# Altium schematic sheet pin-marker-bubbles-1p2.SchDoc
size 101 x 76 mm
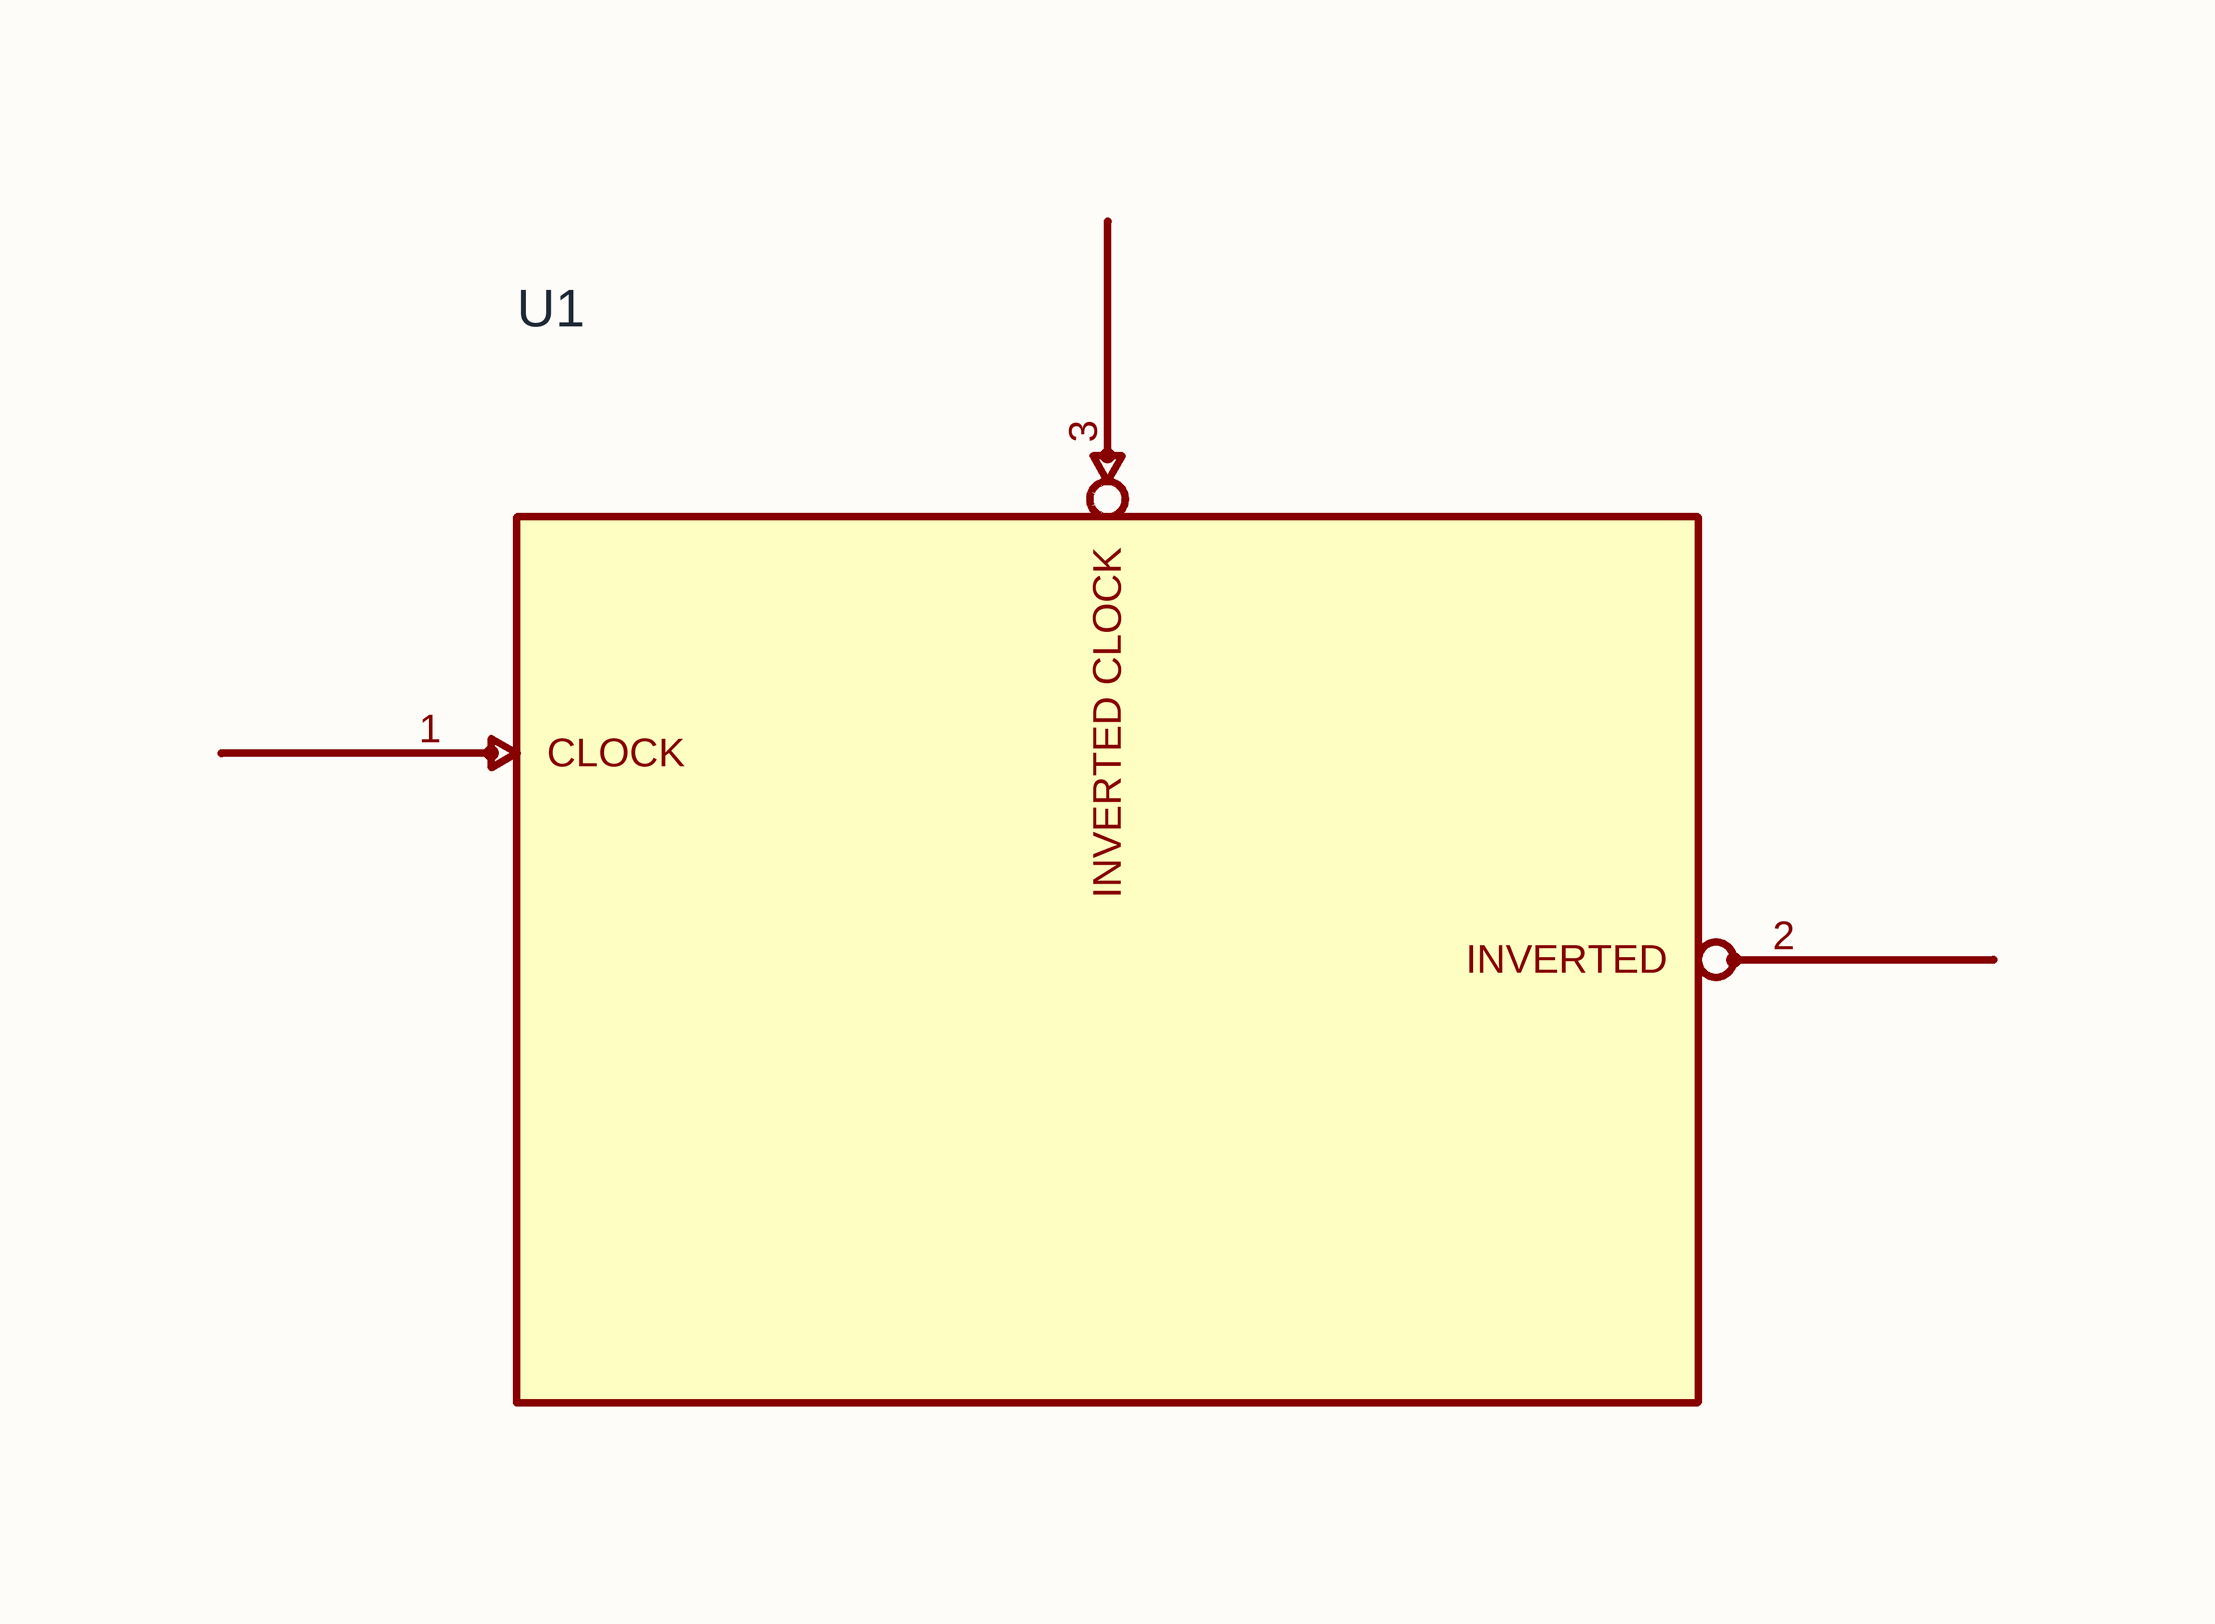
[diagram p0: pin-marker-bubbles-1p2.SchDoc]

## Parts
U1  (no value)

## Nets

Not connected (* = marked no-connect by the designer): U1 1(CLOCK) 2(INVERTED) 3(INVERTED_CLOCK)

## Library data of the parts
U1 = U1